# EAGLE design ATtiny84LEDEL (EAGLE 6.3)
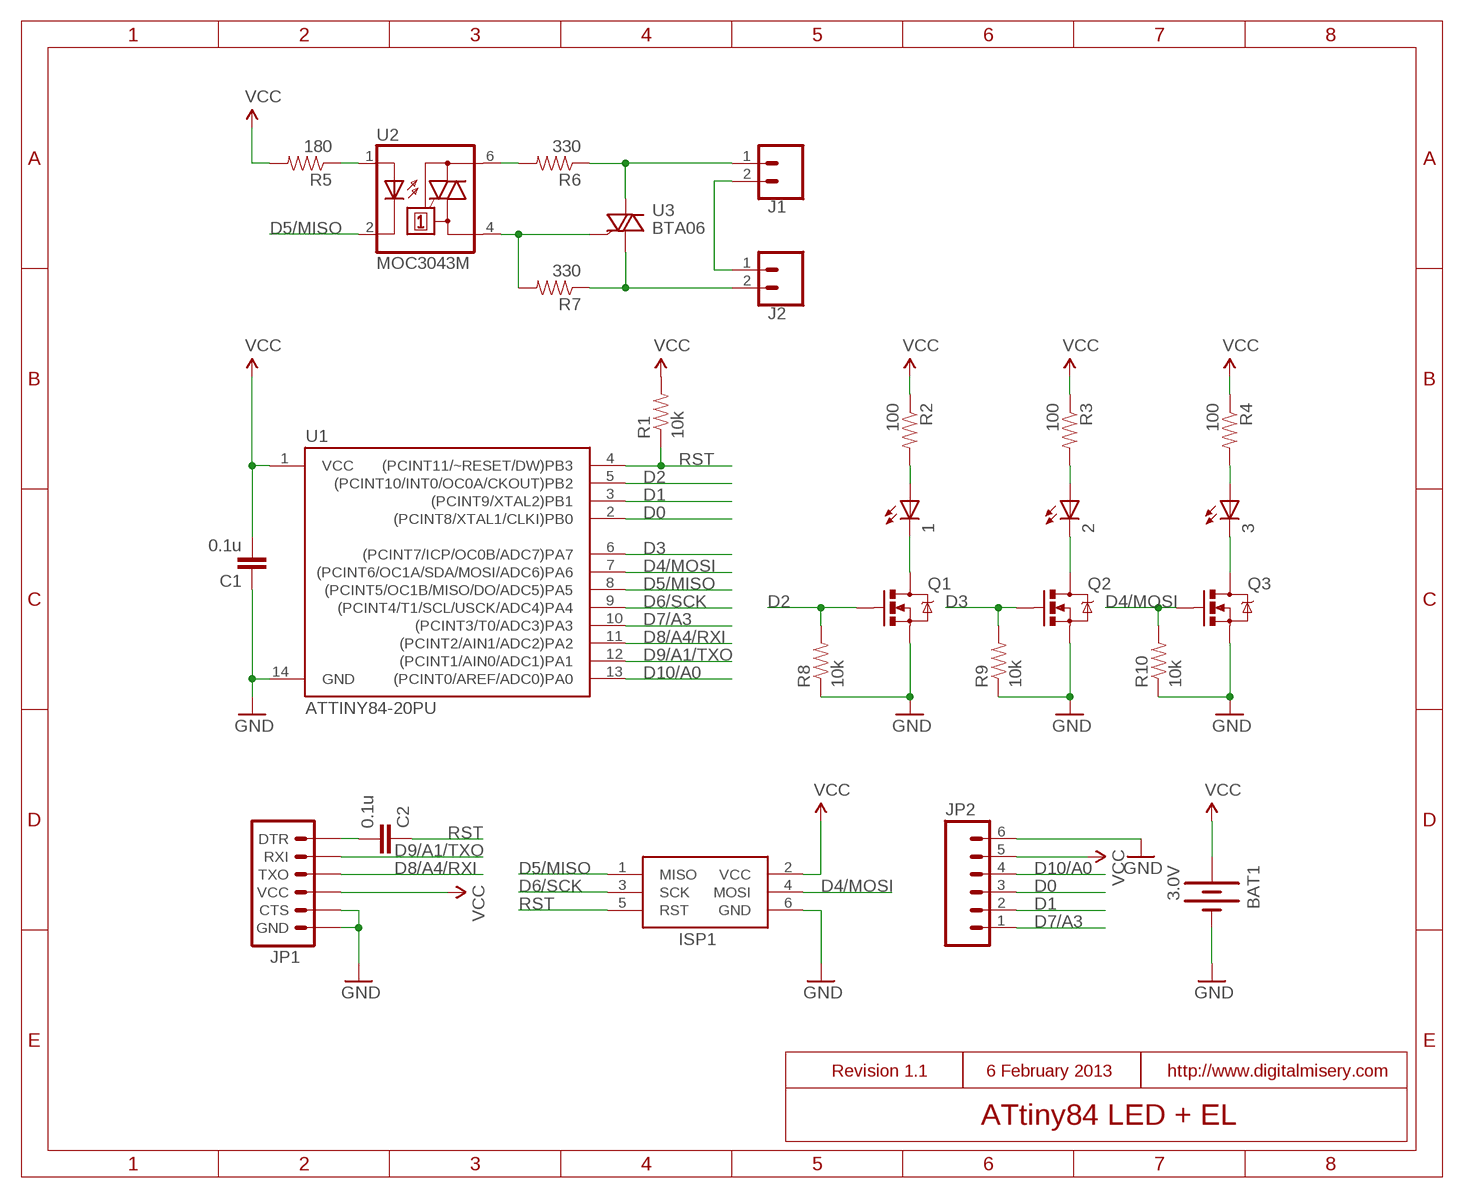
[diagram p0: schematic, sheet 1]

## Parts
1  LED5MM  [LED5MM]
2  LED5MM  [LED5MM]
3  LED5MM  [LED5MM]
BAT1  3.0V  JEELABS_BATTERY20PTH  [JEELABS_BATTCOM_20MM_PTH]
C1  0.1u  CAPPTH  [CAP-PTH-SMALL]
C2  0.1u  CAPPTH  [CAP-PTH-SMALL]
ISP1  AVRISP-6  [AVRISP]
J1  M025MM  [SCREWTERMINAL-5MM-2]
J2  M025MM  [SCREWTERMINAL-5MM-2]
JP1  ARDUINO_SERIAL_PROGRAMLONGPADS  [1X06_LONGPADS]
JP2  M06LONGPADS  [1X06_LONGPADS]
Q1  MOSFET-NCHANNELPTH  [TO-92]
Q2  MOSFET-NCHANNELPTH  [TO-92]
Q3  MOSFET-NCHANNELPTH  [TO-92]
R1  10k  RESISTORPTH-1/4W  [AXIAL-0.4]
R2  100  RESISTORPTH-1/4W  [AXIAL-0.4]
R3  100  RESISTORPTH-1/4W  [AXIAL-0.4]
R4  100  RESISTORPTH-1/4W  [AXIAL-0.4]
R5  180  RESISTORPTH-1/4W  [AXIAL-0.4]
R6  330  RESISTORPTH-1/4W  [AXIAL-0.4]
R7  330  RESISTORPTH-1/4W  [AXIAL-0.4]
R8  10k  RESISTORPTH-1/4W  [AXIAL-0.4]
R9  10k  RESISTORPTH-1/4W  [AXIAL-0.4]
R10  10k  RESISTORPTH-1/4W  [AXIAL-0.4]
U1  ATTINY84-20PU  ATTINY84ATTINY84-20PU  [DIL14]
U2  MOC3043M  [DIL06]
U3  BTA06  [TO220AB]

## Nets
AC1: J1.1 R6.P$1 U3.2(A2)
AC2: J1.2 J2.1
AC3: J2.2 R7.P$1 U3.1(A1)
D0: JP2.3 U1.2((PCINT8/XTAL1/CLKI)PB0)
D1: JP2.2 U1.3((PCINT9/XTAL2)PB1)
D2: Q1.2(G) R8.P$2 U1.5((PCINT10/INT0/OC0A/CKOUT)PB2)
D3: Q2.2(G) R9.P$2 U1.6((PCINT7/ICP/OC0B/ADC7)PA7)
D4/MOSI: ISP1.4(MOSI) Q3.2(G) R10.P$2 U1.7((PCINT6/OC1A/SDA/MOSI/ADC6)PA6)
D5/MISO: ISP1.1(MISO) U1.8((PCINT5/OC1B/MISO/DO/ADC5)PA5) U2.2(C)
D6/SCK: ISP1.3(SCK) U1.9((PCINT4/T1/SCL/USCK/ADC4)PA4)
D7/A3: JP2.1 U1.10((PCINT3/T0/ADC3)PA3)
D8/A4/RXI: JP1.3(TXO) U1.11((PCINT2/AIN1/ADC2)PA2)
D9/A1/TXO: JP1.2(RXI) U1.12((PCINT1/AIN0/ADC1)PA1)
D10/A0: JP2.4 U1.13((PCINT0/AREF/ADC0)PA0)
GND: BAT1.2(-) C1.1 ISP1.6(GND) JP1.5(CTS) JP1.6(GND) JP2.6 Q1.3(S) Q2.3(S) Q3.3(S) R8.P$1 R9.P$1 R10.P$1 U1.14(GND)
N$1: C2.2 JP1.1(DTR)
N$2: R5.P$1 U2.1(A)
N$3: 1.K(C) Q1.1(D)
N$4: 2.K(C) Q2.1(D)
N$5: R6.P$2 U2.6(A2)
N$6: 3.K(C) Q3.1(D)
N$7: R7.P$2 U2.4(A1) U3.3(G)
N$8: 1.A R2.P$2
N$12: 2.A R3.P$2
N$14: 3.A R4.P$2
RST: C2.1 ISP1.5(RST) R1.P$1 U1.4((PCINT11/~RESET/DW)PB3)
VCC: BAT1.1(+) C1.2 ISP1.2(VCC) JP1.4(VCC) JP2.5 R1.P$2 R2.P$1 R3.P$1 R4.P$1 R5.P$2 U1.1(VCC)

## Notes on the sheet
- J1
- J2
- Revision 1.1 | 6 February 2013 | http://www.digitalmisery.com
- ATtiny84 LED + EL

## Library data of the parts
1-3 = adafruit:LED: LED OSRAM: - CHIPLED LG R971, LG N971, LY N971, LG Q971, LY Q971, LO R971, LY R971 LH N974, LH R974 LS Q976, LO Q976, LY Q976 LO Q996 - Hyper CHIPLED LW Q18S LB Q993, LB Q99A, LB R99A - SideLED LS A670, LO A670, LY A670, LG A670, LP A670 LB A673, LV A673, LT A673, LW A673 LH A674 LY A675 LS A676, LA A676, LO A676, LY A676, LW A676 LS A679, LY A679, LG A679 - Hyper Micro SIDELED® LS Y876, LA Y876, LO Y876, LY Y876 LT Y87S - SmartLED LW L88C, LW L88S LB L89C, LB L89S, LG L890 LS L89K, LO L89K, LY L89K LS L896, LA L896, LO L896, LY L896 - TOPLED LS T670, LO T670, LY T670, LG T670, LP T670 LSG T670, LSP T670, LSY T670, LOP T670, LYG T670 LG T671, LOG T671, LSG T671 LB T673, LV T673, LT T673, LW T673 LH T674 LS T676, LA T676, LO T676, LY T676, LB T676, LH T676, LSB T676, LW T676 LB T67C, LV T67C, LT T67C, LS T67K, LO T67K, LY T67K, LW E67C LS E67B, LA E67B, LO E67B, LY E67B, LB E67C, LV E67C, LT E67C LW T67C LS T679, LY T679, LG T679 LS T770, LO T770, LY T770, LG T770, LP T770 LB T773, LV T773, LT T773, LW T773 LH T774 LS E675, LA E675, LY E675, LS T675 LS T776, LA T776, LO T776, LY T776, LB T776 LHGB T686 LT T68C, LB T68C - Hyper Mini TOPLED® LB M676 - Mini TOPLED Santana® LG M470 LS M47K, LO M47K, LY M47K Source: http://www.osram.convergy.de/
BAT1 = jlpcb-144:JEELABS_BATTERY: Battery Holders Various common sizes : AA, AAA, 20mm coin cell and 12mm coin cell.
C1 C2 = SparkFun-Capacitors:CAP: Capacitor Standard 0603 ceramic capacitor, and 0.1" leaded capacitor.
ISP1 = adafruit:AVRISP: AVR ISP HEADER Standard 6 pin header for AVR programming
J1 J2 = SparkFun-Connectors:M02: Header 2 Standard 2-pin 0.1" header. Use with straight break away headers (SKU : PRT-00116), right angle break away headers (PRT-00553), swiss pins (PRT-00743), machine pins (PRT-00117), and female headers (PRT-00115). Molex polarized connector foot print use with SKU : PRT-08233 with associated crimp pins and housings.
JP1 = SparkFun-Connectors:ARDUINO_SERIAL_PROGRAM: FTDI connector footprints
JP2 = SparkFun-Connectors:M06: Header 6 Standard 6-pin 0.1" header. Use with straight break away headers (SKU : PRT-00116), right angle break away headers (PRT-00553), swiss pins (PRT-00743), machine pins (PRT-00117), and female headers (PRT-00115). Molex polarized connector foot print use with SKU : PRT-08094 with associated crimp pins and housings. NOTES ON THE VARIANTS LOCK and LOCK_LONGPADS... This footprint was designed to help hold the alignment of a through-hole component (i.e. 6-pin header) while soldering it into place. You may notice that each hole has been shifted either up or down by 0.005 of an inch from it's more standard position (which is a perfectly straight line). This slight alteration caused the pins (the squares in the middle) to touch the edges of the holes. Because they are alternating, it causes a "brace" to hold the component in place. 0.005 has proven to be the perfect amount of "off-center" position when using our standard breakaway headers. Although looks a little odd when you look at the bare footprint, once you have a header in there, the alteration is very hard to notice. Also, if you push a header all the way into place, it is covered up entirely on the bottom side. This idea of altering the position of holes to aid alignment will be further integrated into the Sparkfun Library for other footprints. It can help hold any component with 3 or more connection pins.
Q1-Q3 = SparkFun-DiscreteSemi:MOSFET-NCHANNEL: Generic NMOS footprint
R1-R10 = SparkFun-Passives:RESISTOR: Resistor Basic schematic elements and footprints for 0603, 1206, and PTH resistors.
U1 = SparkFun-DigitalIC:ATTINY84: Atmel 14-pin 2/4/8kB flash uC
U2 = optocoupler:MOC30*: 6-Pin DIP Zero-Cross Optoisolators Triac Driver Output (250/400 Volt Peak) Source: http://www.fairchildsemi.com/ds/MO/MOC3043-M.pdf; MF: FAIRCHILD SEMICONDUCTOR; MPN: MOC3043-M; OC_FARNELL: 1021371; OC_NEWARK: 72K8900
U3 = my_triac:BTA06: Triac BTA06 series Source: http://www.st.com/internet/com/TECHNICAL_RESOURCES/TECHNICAL_LITERATURE/DATASHEET/CD00000670.pdf

## Board
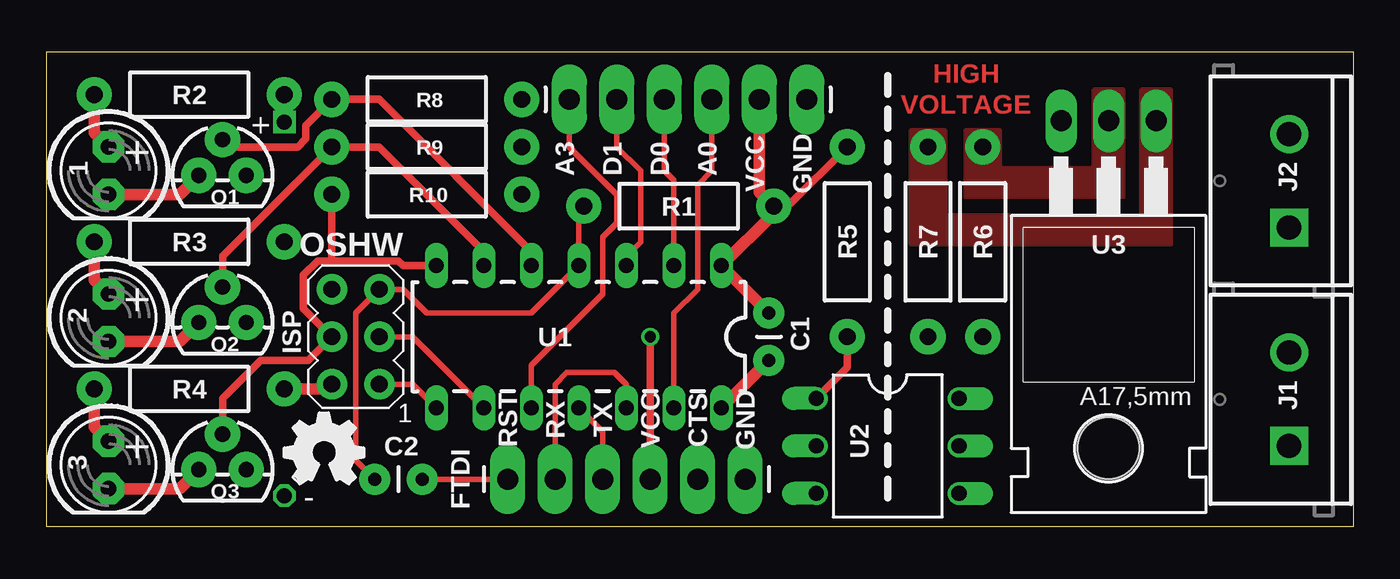
[diagram p1: board, top side]
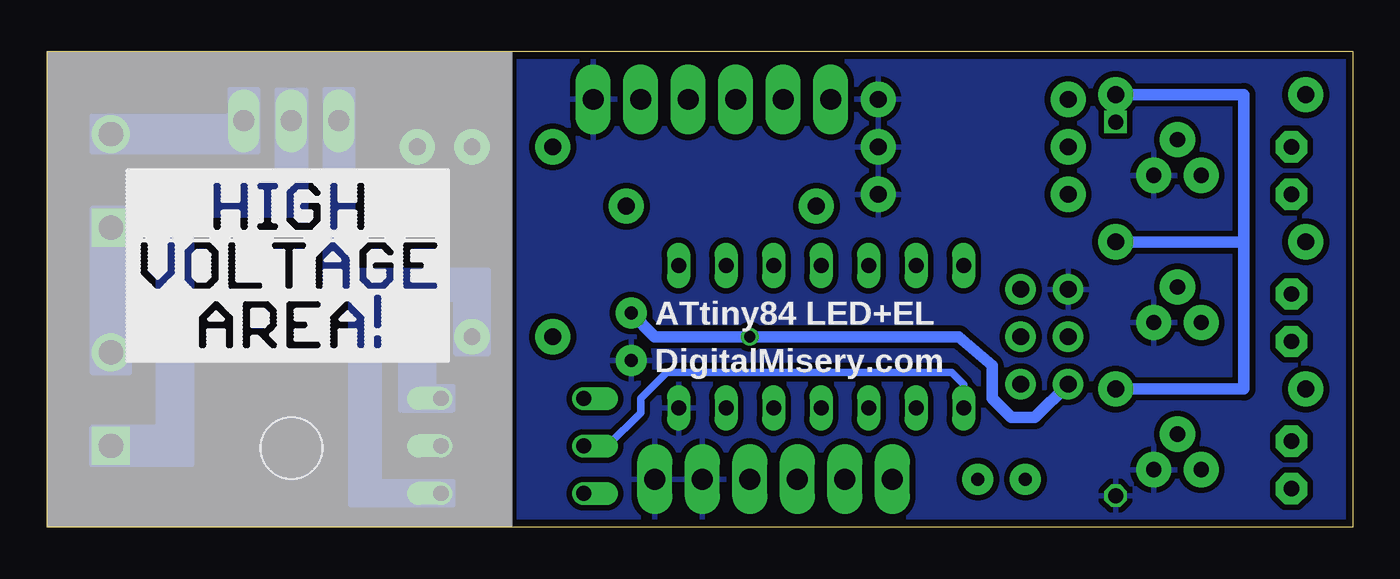
[diagram p2: board, bottom side, seen from below]

Size 69.85 x 25.4 mm. Coordinates in mm from the lower left corner, seen from the top.
Outline: 0,0 0,25.4 69.85,25.4 69.85,0 0,0
Copper layers (1*16): Top 0.0356mm / dielectric 1.5011mm / Bottom 0.0356mm
Design rules "LaenPCBOrder *": minimum track width 10mil, minimum drill 15mil, track to track 12mil, track to pad 12mil, pad to pad 12mil, via to via 12mil, smd to smd 8mil, copper to edge 15mil, drill to drill 10mil, minimum pad ring 7mil, minimum via ring 7mil, stop-mask expansion 4mil, vias tented up to drill 25mil, thermal gap 12mil

### Footprints (pad centres in the part's own frame; a part is rotated, then mirrored left to right if it is on the bottom)
LED5MM = drill 0.813 pad 1.676 octagon: A -1.27,0; K 1.27,0
JEELABS_BATTCOM_20MM_PTH = drill 0.8 square: 1 20,0 | drill 0.8 octagon: 2 0,0
CAP-PTH-SMALL = drill 0.7 pad 1.651: 1 0,0; 2 2.54,0
AVRISP = drill 0.9 pad 1.626: 1 -1.27,2.54; 2 1.27,2.54; 3 -1.27,0; 4 1.27,0; 5 -1.27,-2.54; 6 1.27,-2.54
SCREWTERMINAL-5MM-2 = drill 1.3 pad 2.032 square: 1 0,0 | drill 1.3 pad 2.032: 2 5,0
1X06_LONGPADS = drill 1.118 pad 1.88 long: 1 0,0; 2 2.54,0; 3 5.08,0; 4 7.62,0; 5 10.16,0; 6 12.7,0
TO-92 = drill 0.813 pad 1.88: 1 -1.27,0; 2 0,1.905; 3 1.27,0
AXIAL-0.4 = drill 0.9 pad 1.88: P$1 -5.08,0; P$2 5.08,0
DIL14 = drill 0.813 long: 1 -8.89,-3.81; 2 -6.35,-3.81; 3 -3.81,-3.81; 4 -1.27,-3.81; 5 1.27,-3.81; 6 3.81,-3.81; 7 6.35,-3.81; 8 6.35,3.81; 9 3.81,3.81; 10 1.27,3.81; 11 -1.27,3.81; 12 -3.81,3.81; 13 -6.35,3.81; 14 -8.89,3.81
DIL06 = drill 0.813 offset: 1 -2.54,-3.81; 2 0,-3.81; 3 2.54,-3.81; 4 2.54,3.81; 5 0,3.81; 6 -2.54,3.81
TO220AB = drill 1.118 long: 1 -2.54,-6.35; 2 0,-6.35; 3 2.54,-6.35 | hole 3.302: 0,11.176

### Placement (x,y rotation side)
1  3.3,19.05 270 top
2  3.3,11.18 270 top
3  3.3,3.3 270 top
BAT1  12.7,1.65 90 bottom
C1  38.61,8.89 90 top
C2  17.53,2.54 0 top
ISP1  16.51,10.16 180 top
J1  66.42,4.32 90 top
J2  66.42,16 90 top
JP1  24.64,2.54 0 top
JP2  27.94,22.86 0 top
Q1  9.4,18.8 0 top
Q2  9.4,10.92 0 top
Q3  9.4,3.05 0 top
R1  33.78,17.14 0 top
R2  7.62,23.11 180 top
R3  7.62,15.24 180 top
R4  7.62,7.37 180 top
R5  42.8,15.24 90 top
R6  50.04,15.24 270 top
R7  47.12,15.24 270 top
R8  20.32,22.86 180 top
R9  20.32,20.32 180 top
R10  20.32,17.78 180 top
U1  27.18,10.16 180 top
U2  44.96,4.32 270 top
U3  56.77,15.37 180 top
U$1  [OSHW_FILLX150_NOTEXT]  12.7,2.29 0 top

### Tracks (layer width: path | path; a pad name or v marks a point on that pad's centre or on a via)
AC1
  pour Bottom (no thermals): 67.44,3.3 67.44,5.33 63.88,5.33 63.88,18.41 57.53,18.41 57.53,23.37 56.01,23.37 56.01,16.64 62.1,16.64 62.1,3.3
  pour Top (no thermals): 49.15,21.21 50.93,21.21 50.93,19.18 56.01,19.18 56.01,23.37 57.53,23.37 57.53,17.65 49.15,17.65
AC2
  pour Bottom (no thermals): 65.41,17.02 67.44,17.02 67.44,8.26 65.41,8.26
AC3
  pour Bottom (no thermals): 58.55,23.37 60.07,23.37 60.07,21.97 67.44,21.97 67.44,20.07 58.55,20.07
  pour Top (no thermals): 48.01,21.21 48.01,16.64 58.55,16.64 58.55,23.37 60.07,23.37 60.07,15.11 46.23,15.11 46.23,21.21
D0
  Top 0.305: U1.2 33.53,18.54 33.02,19.05 JP2.3
D1
  Top 0.305: U1.3 30.99,14.48 31.75,15.24 31.75,19.05 30.48,20.32 JP2.2
D2
  Top 0.406: Q1.2 9.78,20.32 13.41,20.32 13.84,20.75 13.84,21.46 R8.P$2 17.78,22.86 25.91,14.73 U1.5
D3
  Top 0.406: Q2.2 9.4,14.48 R9.P$2 17.78,20.32 23.37,14.73 U1.6
D4/MOSI
  Top 0.406: Q3.2 9.4,6.86 11.43,8.89 13.97,8.89 ISP1.4 13.72,11.68 13.72,13.46 14.48,14.22 15.24,14.22 | U1.7 19.05,13.97 18.8,14.22 15.24,14.22 | R10.P$2 15.24,14.22
D5/MISO
  Top 0.305: ISP1.1 19.56,7.62 U1.8
  Bottom 0.406: U1.8 20.83,7.62 21.46,8.26 36.7,8.26 38.1,6.86 38.1,6.1 39.88,4.32 U2.2
D6/SCK
  Top 0.305: ISP1.3 19.56,10.16 U1.9
D7/A3
  Top 0.305: U1.10 25.91,8.64 29.72,12.45 29.72,15.49 30.48,16.26 30.48,17.78 27.94,20.32 JP2.1
D8/A4/RXI
  Top 0.305: U1.11 29.72,5.08 JP1.3
D9/A1/TXO
  Top 0.305: U1.12 30.99,7.62 30.35,8.26 27.81,8.26 27.18,7.62 JP1.2
D10/A0
  Top 0.305: U1.13 33.53,11.43 34.8,12.7 34.8,18.29 35.56,19.05 JP2.4
GND
  Top 0.61: C1.1 U1.14
  pour Bottom (isolate 0.254): 0,25.4 44.58,25.27 44.58,-0.13 0,0
N$1
  Top 0.305: C2.2 JP1.1
N$2
  Top 0.406: U2.1 42.8,8.51 R5.P$1
N$3
  Top 0.61: Q1.1 7.11,17.78 1.K
N$4
  Top 0.61: 2.K 7.11,9.91 Q2.1
N$5
  pour Bottom (no thermals): 48.13,6.22 50.93,6.22 50.93,11.05 49.15,11.05 49.15,7.49 48.13,7.49
N$6
  Top 0.61: 3.K 7.11,2.03 Q3.1
N$7
  pour Bottom (no thermals): 53.47,23.37 54.99,23.37 54.99,13.34 53.47,13.34
  pour Bottom (no thermals): 48.13,2.41 48.13,1.14 53.59,1.14 53.59,12.32 52.07,12.32 52.07,2.41
  pour Bottom (no thermals): 46.23,9.27 46.23,13.72 54.99,13.72 54.99,12.19 48.01,12.19 48.01,9.27
N$8
  Top 0.61: R2.P$2 2.54,21.08 1.A
N$12
  Top 0.61: R3.P$2 2.54,13.21 2.A
N$14
  Top 0.61: R4.P$2 2.54,5.33 3.A
RST
  Top 0.305: C2.1 16.51,3.56 16.51,11.43 ISP1.5 19.05,12.7 20.32,11.43 25.91,11.43 U1.4 28.45,16.89 R1.P$1
VCC  (via drill 0.6)
  Top 0.406: JP1.4 v32.26,10.16 | R1.P$2 39.62,17.14 R5.P$2
  Top 0.61: C1.2 U1.1 38.86,16.76 R1.P$2 38.1,17.91 JP2.5 | ISP1.2 14.99,7.37 R4.P$1
  Bottom 0.61: C1.2 37.34,10.16 v32.26,10.16 21.08,10.16 19.3,8.64 19.3,6.86 18.29,5.84 17.02,5.84 ISP1.2 | 12.7,7.62 R4.P$1 5.84,7.37 5.84,15.24 | R3.P$1 5.84,15.24 | 5.84,15.24 5.84,23.11 R2.P$1 BAT1.1

### Text on the board
Top: HIGH | VOLTAGE
tPlace: + | A3 | D1 | D0 | A0 | VCC | GND | OSHW | + | ISP | RST | RX | TX | VCC | CTS | GND | + | FTDI
bPlace: ATtiny84 LED+EL | DigitalMisery.com
tStop: HIGH | VOLTAGE